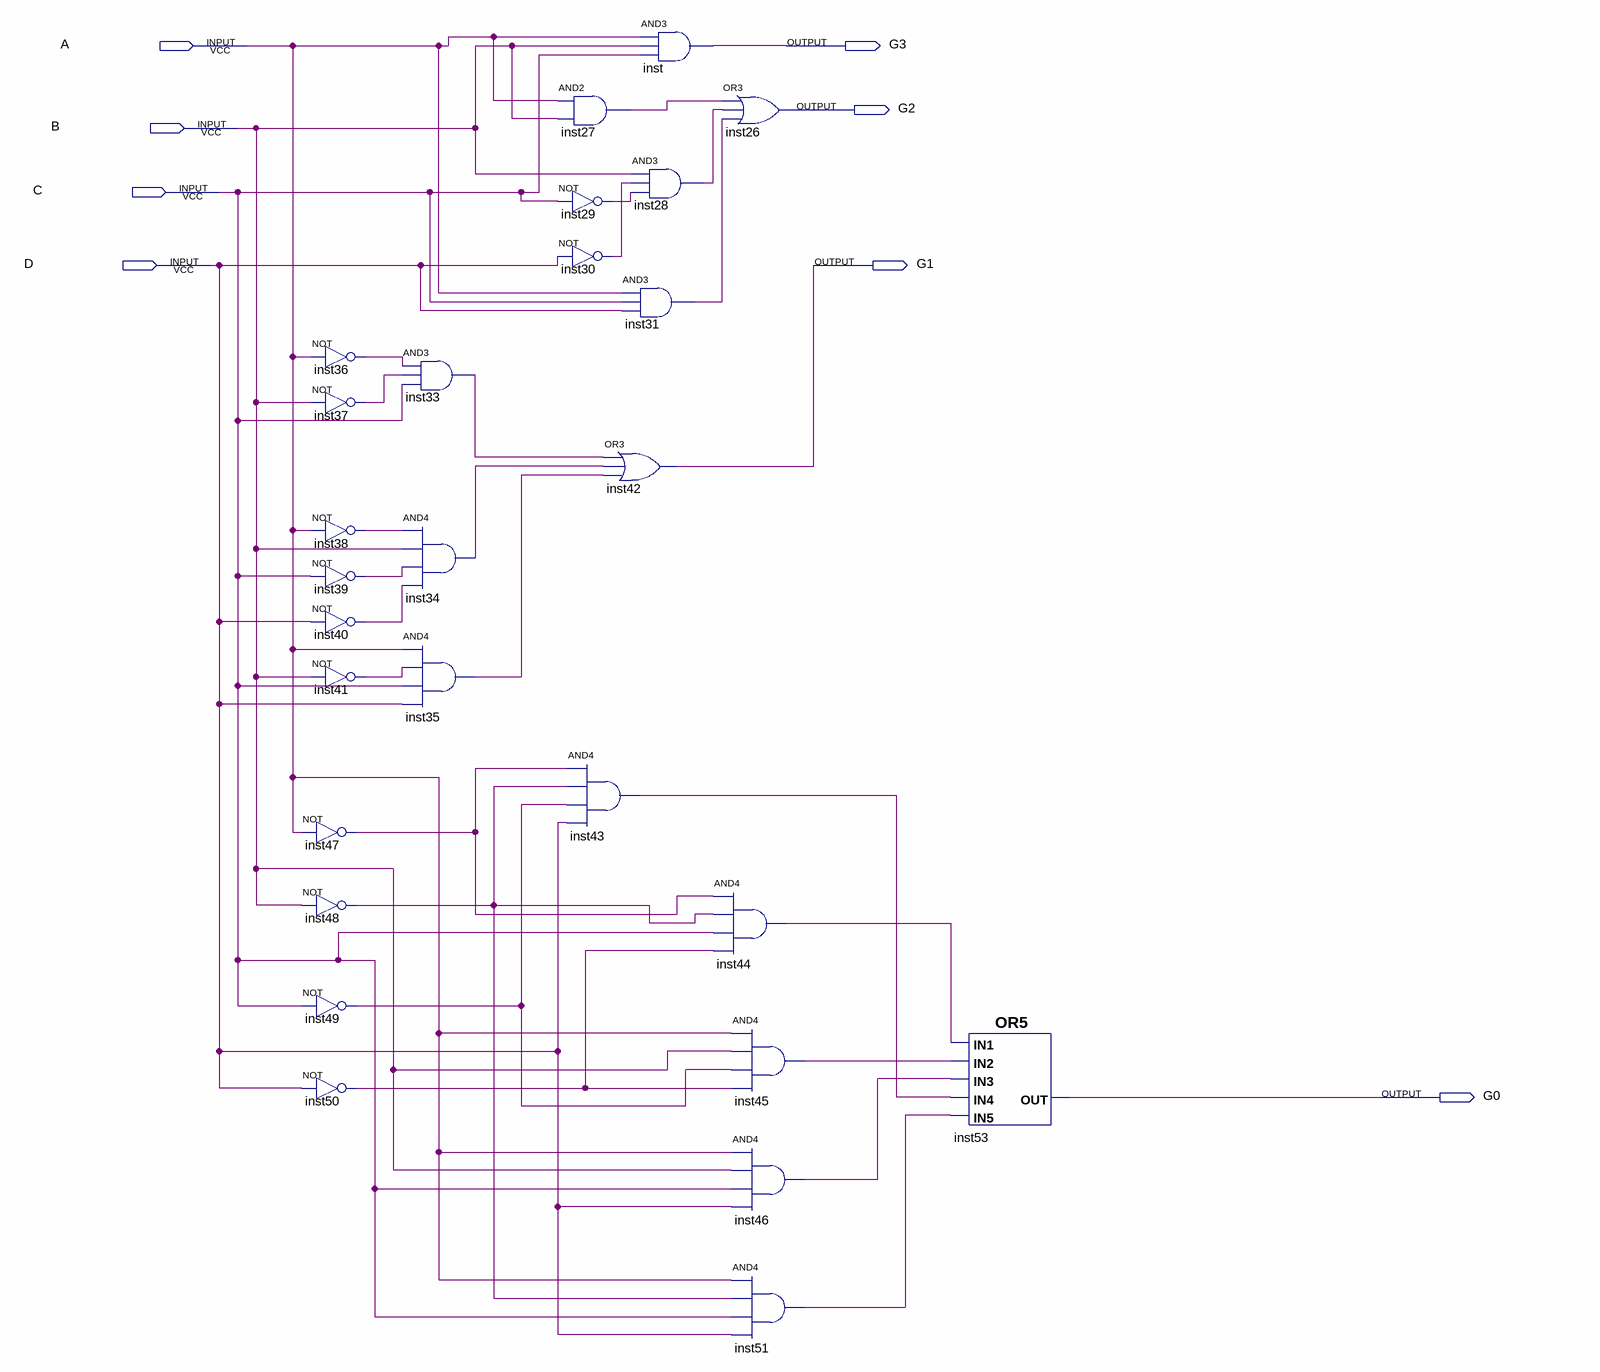
[diagram p0: schematic sheet]
// Quartus schematic w3_2421-gray.bdf as structural Verilog: 27 symbols, 8 pins
module \w3_2421-gray  (
  input  A,
  input  B,
  input  C,
  input  D,
  output G3,
  output G2,
  output G1,
  output G0
);

  wire inst27_out, inst28_out, inst29_out, inst30_out, inst31_out, inst33_out, inst34_out, inst35_out,
       inst36_out, inst37_out, inst38_out, inst39_out, inst40_out, inst41_out, inst43_out, inst44_out,
       inst45_out, inst46_out, inst47_out, inst48_out, inst49_out, inst50_out, inst51_out;

  not inst47 (inst47_out, A);
  not inst48 (inst48_out, B);
  not inst49 (inst49_out, C);
  not inst50 (inst50_out, D);
  not inst36 (inst36_out, A);
  not inst37 (inst37_out, B);
  not inst38 (inst38_out, A);
  not inst39 (inst39_out, C);
  not inst40 (inst40_out, D);
  not inst41 (inst41_out, B);
  and inst33 (inst33_out, inst36_out, inst37_out, C);
  and inst34 (inst34_out, inst38_out, B, inst39_out, inst40_out);
  and inst35 (inst35_out, A, inst41_out, C, D);
  and inst27 (inst27_out, A, B);
  not inst29 (inst29_out, C);
  not inst30 (inst30_out, D);
  and inst43 (inst43_out, inst47_out, inst48_out, inst49_out, D);
  and inst (G3, A, B, C);
  and inst28 (inst28_out, B, inst30_out, inst29_out);
  and inst31 (inst31_out, A, C, D);
  or inst42 (G1, inst33_out, inst34_out, inst35_out);
  or inst26 (G2, inst27_out, inst28_out, inst31_out);
  and inst44 (inst44_out, inst47_out, inst48_out, C, inst50_out);
  and inst45 (inst45_out, A, B, inst49_out, inst50_out);
  and inst46 (inst46_out, A, B, C, D);
  and inst51 (inst51_out, A, inst48_out, C, D);
  or inst53 (G0, inst44_out, inst45_out, inst46_out, inst43_out, inst51_out);
endmodule
